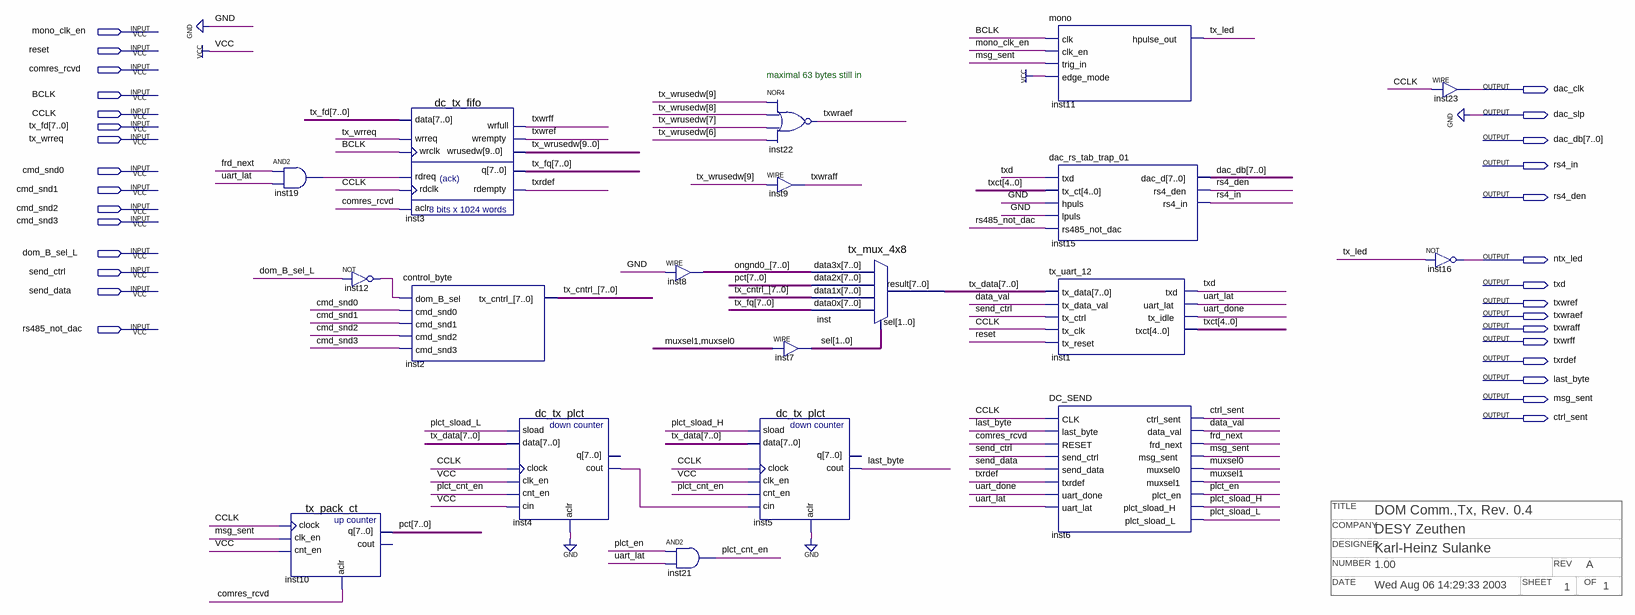
[diagram p0: schematic sheet]
// Quartus schematic DC_Tx_chan_01.bdf as structural Verilog: 19 symbols, 30 pins
// Title block: TITLE: DOM Comm.,Tx, Rev. 0.4; COMPANY: DESY Zeuthen; DESIGNER: Karl-Heinz Sulanke; NUMBER: 1.00; REV: A; DATE: Wed Aug 06 14:29:33 2003; SHEET: 1; OF: 1
module DC_Tx_chan_01 (
  input  mono_clk_en,
  input  reset,
  input  comres_rcvd,
  input  BCLK,
  input  CCLK,
  input  [7:0] tx_fd,
  input  tx_wrreq,
  input  cmd_snd0,
  input  cmd_snd1,
  input  cmd_snd2,
  input  cmd_snd3,
  input  dom_B_sel_L,
  input  send_ctrl,
  input  send_data,
  input  rs485_not_dac,
  output dac_clk,
  output dac_slp,
  output [7:0] dac_db,
  output rs4_in,
  output rs4_den,
  output ntx_led,
  output txd,
  output txwref,
  output txwraef,
  output txwraff,
  output txwrff,
  output txrdef,
  output last_byte,
  output msg_sent,
  output ctrl_sent
);

  wire data_val, frd_next, inst4_cout, inst12_out, inst19_out, muxsel0, muxsel1, plct_cnt_en, plct_en,
       plct_sload_H, plct_sload_L, tx_led, uart_done, uart_lat;
  wire [1:0] sel;
  wire [4:0] txct;
  wire [7:0] ongnd0_, pct, tx_cntrl_, tx_data, tx_fq;
  wire [9:0] tx_wrusedw;

  and inst19 (inst19_out, frd_next, uart_lat);
  tx_pack_ct inst10 (.clock(CCLK), .clk_en(msg_sent), .cnt_en(1'b1), .aclr(comres_rcvd), .q(pct));  // open: cout
  not inst12 (inst12_out, dom_B_sel_L);
  dc_tx_fifo inst3 (
    .data(tx_fd), .wrreq(tx_wrreq), .wrclk(BCLK), .rdreq(inst19_out), .rdclk(CCLK), .aclr(comres_rcvd),
    .wrfull(txwrff), .wrempty(txwref), .wrusedw(tx_wrusedw), .q(tx_fq), .rdempty(txrdef));
  control_byte inst2 (
    .dom_B_sel(inst12_out), .cmd_snd0(cmd_snd0), .cmd_snd1(cmd_snd1), .cmd_snd2(cmd_snd2),
    .cmd_snd3(cmd_snd3), .tx_cntrl_(tx_cntrl_));
  dc_tx_plct inst4 (
    .sload(plct_sload_L), .data(tx_data), .clock(CCLK), .clk_en(1'b1), .cnt_en(plct_cnt_en), .cin(1'b1),
    .aclr(1'b0), .cout(inst4_cout));  // open: q
  assign ongnd0_ = {8{1'b0}};  // WIRE inst8
  and inst21 (plct_cnt_en, plct_en, uart_lat);
  nor inst22 (txwraef, tx_wrusedw[9], tx_wrusedw[8], tx_wrusedw[7], tx_wrusedw[6]);
  assign txwraff = tx_wrusedw[9];  // WIRE inst9
  dc_tx_plct inst5 (
    .sload(plct_sload_H), .data(tx_data), .clock(CCLK), .clk_en(1'b1), .cnt_en(plct_cnt_en),
    .cin(inst4_cout), .aclr(1'b0), .cout(last_byte));  // open: q
  tx_mux_4x8 inst (.data3x(ongnd0_), .data2x(pct), .data1x(tx_cntrl_), .data0x(tx_fq), .sel(sel), .result(tx_data));
  assign sel = {muxsel1, muxsel0};  // WIRE inst7
  mono inst11 (.clk(BCLK), .clk_en(mono_clk_en), .trig_in(msg_sent), .edge_mode(1'b1), .hpulse_out(tx_led));
  dac_rs_tab_trap_01 inst15 (
    .txd(txd), .tx_ct(txct), .hpuls(1'b0), .lpuls(1'b0), .rs485_not_dac(rs485_not_dac), .dac_d(dac_db),
    .rs4_den(rs4_den), .rs4_in(rs4_in));
  tx_uart_12 inst1 (
    .tx_data(tx_data), .tx_data_val(data_val), .tx_ctrl(send_ctrl), .tx_clk(CCLK), .tx_reset(reset),
    .txd(txd), .uart_lat(uart_lat), .tx_idle(uart_done), .txct(txct));
  DC_SEND inst6 (
    .CLK(CCLK), .last_byte(last_byte), .RESET(comres_rcvd), .send_ctrl(send_ctrl), .send_data(send_data),
    .txrdef(txrdef), .uart_done(uart_done), .uart_lat(uart_lat), .ctrl_sent(ctrl_sent), .data_val(data_val),
    .frd_next(frd_next), .msg_sent(msg_sent), .muxsel0(muxsel0), .muxsel1(muxsel1), .plct_en(plct_en),
    .plct_sload_H(plct_sload_H), .plct_sload_L(plct_sload_L));
  not inst16 (ntx_led, tx_led);
  assign dac_clk = CCLK;  // WIRE inst23

  assign dac_slp = 1'b0;

  // Notes on the sheet:
  //   maximal 63 bytes still in
endmodule
